# EAGLE design csa_copro_addon-v1.0b (EAGLE 4.15)
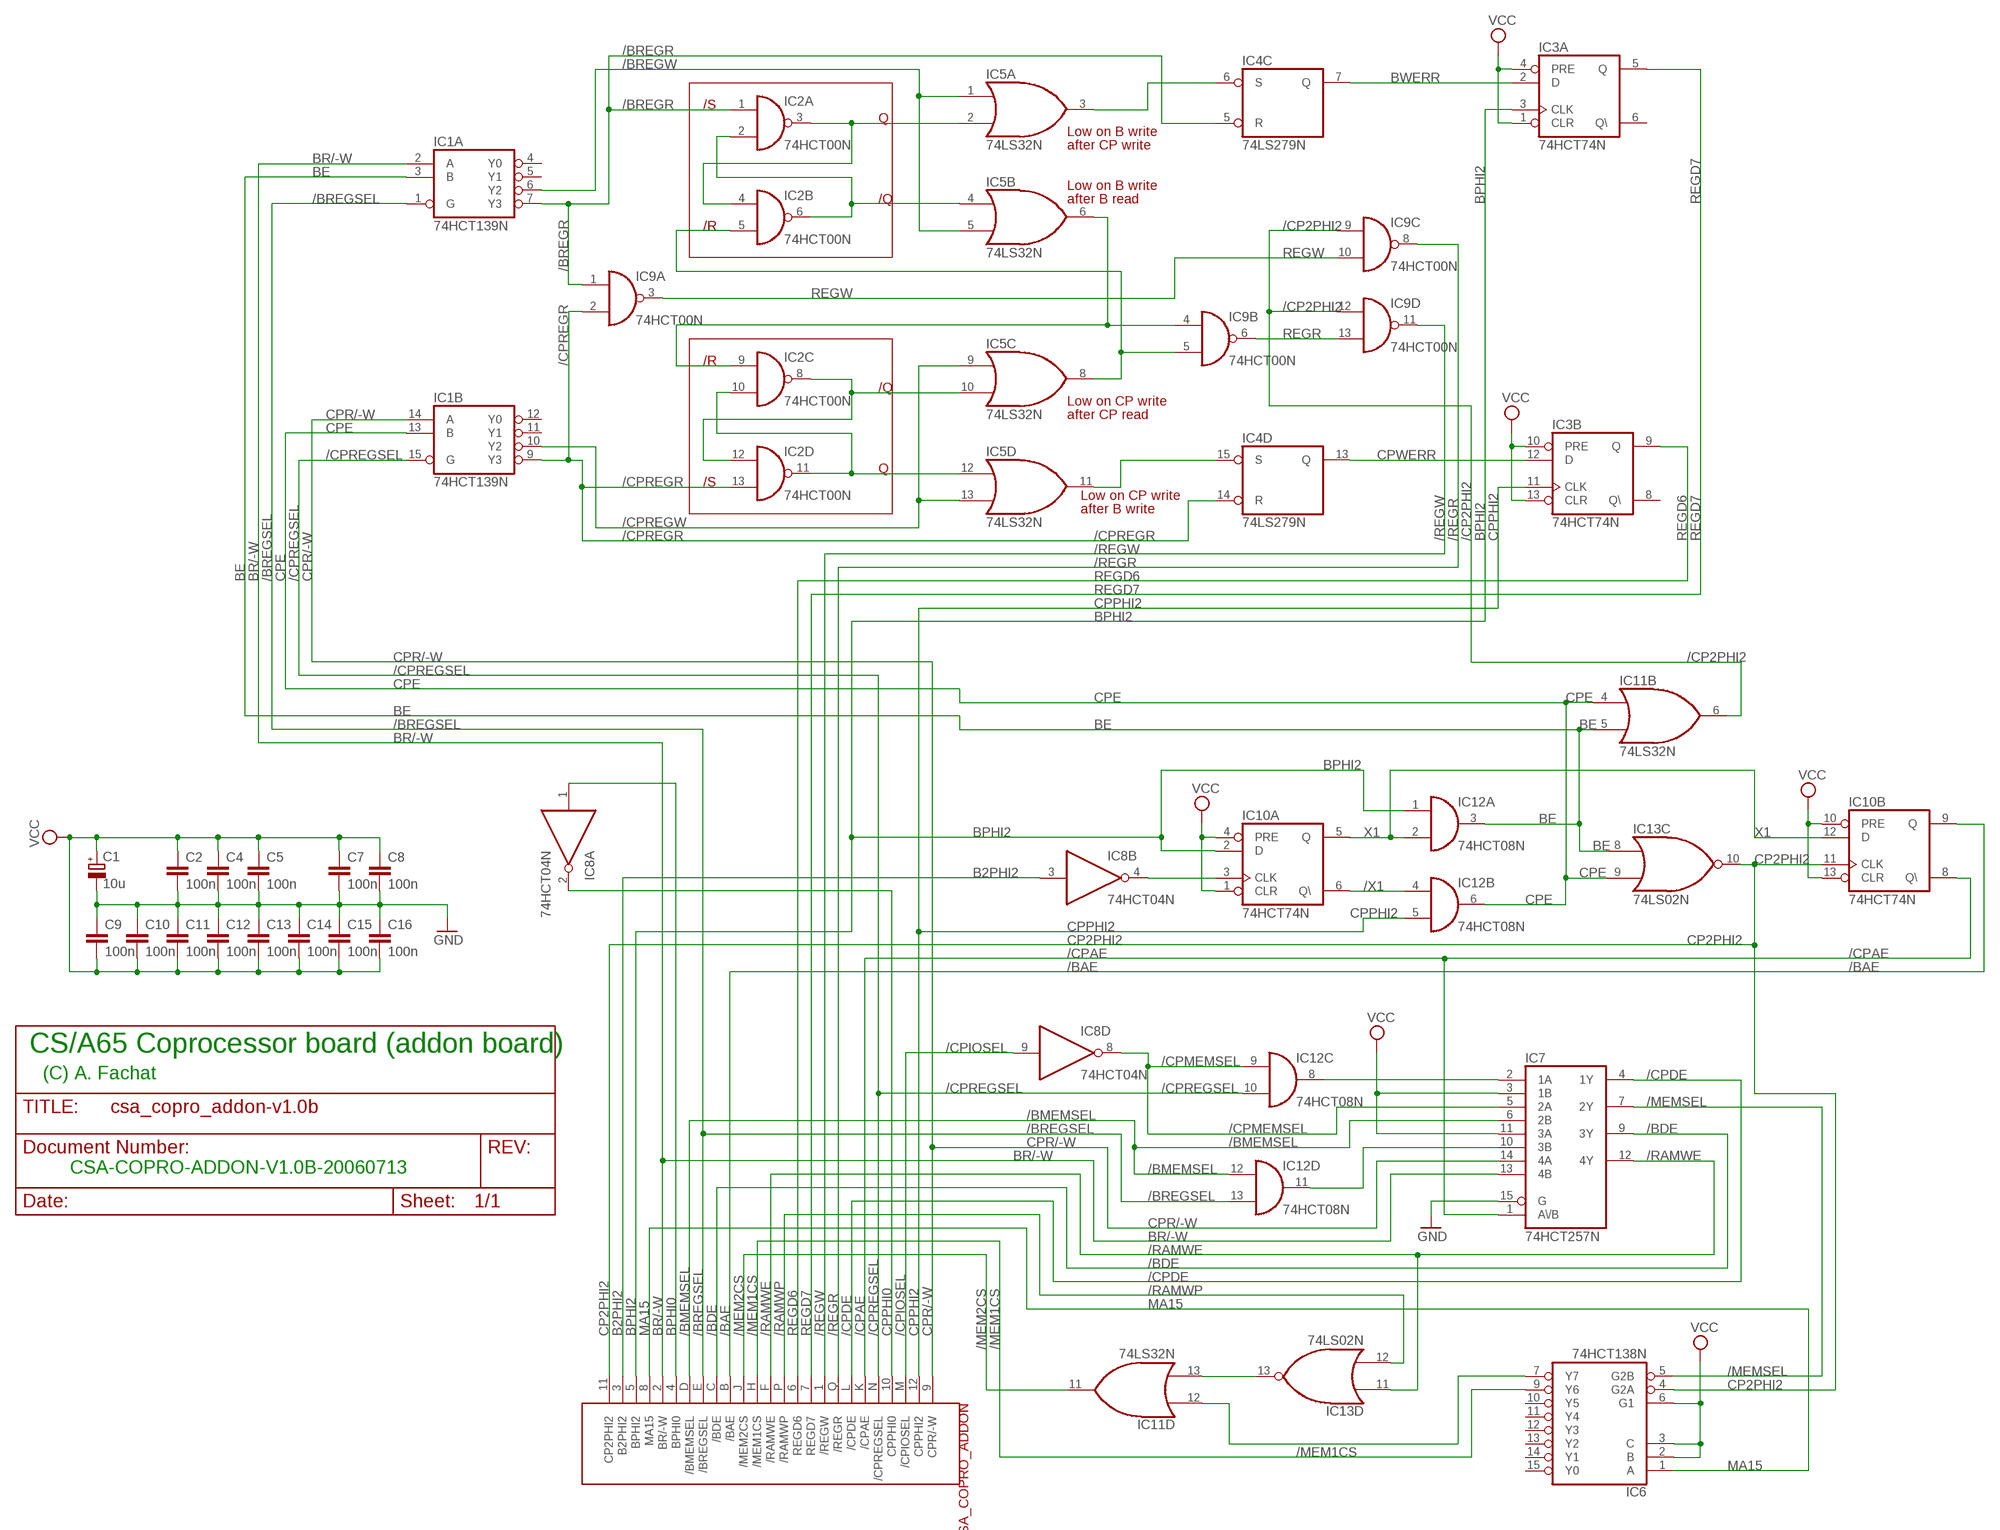
[diagram p0: schematic, sheet 1]

## Parts
C1  10u  CPOL-EUE2.5-5  [E2,5-5]
C2  100n  C-EU025-025X050  [C025-025X050]
C4  100n  C-EU025-025X050  [C025-025X050]
C5  100n  C-EU025-025X050  [C025-025X050]
C7  100n  C-EU025-025X050  [C025-025X050]
C8  100n  C-EU025-025X050  [C025-025X050]
C9  100n  C-EU025-025X050  [C025-025X050]
C10  100n  C-EU025-025X050  [C025-025X050]
C11  100n  C-EU025-025X050  [C025-025X050]
C12  100n  C-EU025-025X050  [C025-025X050]
C13  100n  C-EU025-025X050  [C025-025X050]
C14  100n  C-EU025-025X050  [C025-025X050]
C15  100n  C-EU025-025X050  [C025-025X050]
C16  100n  C-EU025-025X050  [C025-025X050]
IC1  74HCT139N  [DIL16]
IC2  74HCT00N  [DIL14]
IC3  74HCT74N  [DIL14]
IC4  74LS279N  [DIL16]
IC5  74LS32N  [DIL14]
IC6  74HCT138N  [DIL16]
IC7  74HCT257N  [DIL16]
IC8  74HCT04N  [DIL14]
IC9  74HCT00N  [DIL14]
IC10  74HCT74N  [DIL14]
IC11  74LS32N  [DIL14]
IC12  74HCT08N  [DIL14]
IC13  74LS02N  [DIL14]
P3  CSA_COPRO_ADDON  [FLAT28]

## Nets
/BAE: IC10.9(B:Q) P3.B(/BAE)
/BDE: IC7.9(3Y) P3.C(/BDE)
/BMEMSEL: IC7.6(2B) IC12.12(D:I0) P3.D(/BMEMSEL)
/BREGR: IC1.7(A:Y3) IC2.1(A:I0) IC4.5(C:R) IC9.1(A:I0)
/BREGSEL: IC1.1(A:G) IC12.13(D:I1) P3.E(/BREGSEL)
/BREGW: IC1.6(A:Y2) IC5.1(A:I0) IC5.5(B:I1)
/CP2PHI2: IC9.9(C:I0) IC9.12(D:I0) IC11.6(B:O)
/CPAE: IC7.1(A\/B) IC10.8(B:Q\) P3.K(/CPAE)
/CPDE: IC7.4(1Y) P3.L(/CPDE)
/CPIOSEL: IC8.9(D:I) P3.M(/CPIOSEL)
/CPMEMSEL: IC7.5(2A) IC8.8(D:O) IC12.9(C:I0)
/CPREGR: IC1.9(B:Y3) IC2.13(D:I1) IC4.14(D:R) IC9.2(A:I1)
/CPREGSEL: IC1.15(B:G) IC12.10(C:I1) P3.N(/CPREGSEL)
/CPREGW: IC1.10(B:Y2) IC5.9(C:I0) IC5.13(D:I1)
/MEM1CS: IC6.9(Y6) P3.H(/MEM1CS)
/MEM2CS: IC11.11(D:O) P3.J(/MEM2CS)
/MEMSEL: IC6.5(G2B) IC7.7(2Y)
/RAMWE: IC7.12(4Y) IC13.11(D:I0) P3.F(/RAMWE)
/RAMWP: IC13.12(D:I1) P3.P(/RAMWP)
/REGR: IC9.8(C:O) P3.Q(/REGR)
/REGW: IC9.11(D:O) P3.1(/REGW)
/X1: IC10.6(A:Q\) IC12.4(B:I0)
B2PHI2: IC8.3(B:I) P3.3(B2PHI2)
BE: IC1.3(A:B) IC11.5(B:I1) IC12.3(A:O) IC13.8(C:I0)
BPHI0: IC8.1(A:I) P3.4(BPHI0)
BPHI2: IC3.3(A:CLK) IC10.2(A:D) IC12.1(A:I0) P3.5(BPHI2)
BR/-W: IC1.2(A:A) IC7.13(4B) P3.2(BR/-W)
BWERR: IC3.2(A:D) IC4.7(C:Q)
CP2PHI2: IC6.4(G2A) IC10.11(B:CLK) IC13.10(C:O) P3.11(CP2PHI2)
CPE: IC1.13(B:B) IC11.4(B:I0) IC12.6(B:O) IC13.9(C:I1)
CPPHI0: IC8.2(A:O) P3.10(CPPHI0)
CPPHI2: IC3.11(B:CLK) IC12.5(B:I1) P3.12(CPPHI2)
CPR/-W: IC1.14(B:A) IC7.14(4A) P3.9(CPR/-W)
CPWERR: IC3.12(B:D) IC4.13(D:Q)
GND: C1.- C2.2 C4.2 C5.2 C7.2 C8.2 C9.1 C10.1 C11.1 C12.1 C13.1 C14.1 C15.1 C16.1 IC7.15(G)
MA15: IC6.1(A) P3.8(MA15)
N$9: IC2.3(A:O) IC2.4(B:I0) IC5.2(A:I1)
N$10: IC2.2(A:I1) IC2.6(B:O) IC5.4(B:I0)
N$11: IC2.8(C:O) IC2.12(D:I0) IC5.10(C:I1)
N$12: IC2.10(C:I1) IC2.11(D:O) IC5.12(D:I0)
N$14: IC4.15(D:S) IC5.11(D:O)
N$16: IC6.7(Y7) IC11.12(D:I0)
N$17: IC2.5(B:I1) IC5.8(C:O) IC9.5(B:I1)
N$18: IC2.9(C:I0) IC5.6(B:O) IC9.4(B:I0)
N$19: IC11.13(D:I1) IC13.13(D:O)
N$20: IC4.6(C:S) IC5.3(A:O)
N$32: IC8.4(B:O) IC10.3(A:CLK)
N$41: IC7.2(1A) IC12.8(C:O)
N$43: IC7.10(3B) IC12.11(D:O)
REGD6: IC3.9(B:Q) P3.6(REGD6)
REGD7: IC3.5(A:Q) P3.7(REGD7)
REGR: IC9.6(B:O) IC9.13(D:I1)
REGW: IC9.3(A:O) IC9.10(C:I1)
VCC: C1.+ C2.1 C4.1 C5.1 C7.1 C8.1 C9.2 C10.2 C11.2 C12.2 C13.2 C14.2 C15.2 C16.2 IC3.1(A:CLR) IC3.4(A:PRE) IC3.10(B:PRE) IC3.13(B:CLR) IC6.2(B) IC6.3(C) IC6.6(G1) IC7.3(1B) IC7.11(3A) IC10.1(A:CLR) IC10.4(A:PRE) IC10.10(B:PRE) IC10.13(B:CLR)
X1: IC10.5(A:Q) IC10.12(B:D) IC12.2(A:I1)
Unconnected: IC1.4(A:Y0) IC1.5(A:Y1) IC1.11(B:Y1) IC1.12(B:Y0) IC3.6(A:Q\) IC3.8(B:Q\) IC4.1(A:R) IC4.2(A:S1) IC4.3(A:S2) IC4.4(A:Q) IC4.9(B:Q) IC4.10(B:R) IC4.11(B:S1) IC4.12(B:S2) IC6.10(Y5) IC6.11(Y4) IC6.12(Y3) IC6.13(Y2) IC6.14(Y1) IC6.15(Y0) IC8.5(C:I) IC8.6(C:O) IC8.10(E:O) IC8.11(E:I) IC8.12(F:O) IC8.13(F:I) IC11.1(A:I0) IC11.2(A:I1) IC11.3(A:O) IC11.8(C:O) IC11.9(C:I0) IC11.10(C:I1) IC13.1(A:O) IC13.2(A:I0) IC13.3(A:I1) IC13.4(B:O) IC13.5(B:I0) IC13.6(B:I1)

## Notes on the sheet
- /S
- Q
- Low on B write
- after CP write
- Low on B write
- /Q | after B read
- /R
- /R
- /Q
- Low on CP write
- after CP read
- Q
- /S
- Low on CP write
- after B write
- CS/A65 Coprocessor board (addon board)
- (C) A. Fachat
- CSA-COPRO-ADDON-V1.0B-20060713

## Power pins joined to a net without a drawn wire
GND: IC1.8(P:GND) IC2.7(P:GND) IC3.7(P:GND) IC4.8(P:GND) IC5.7(P:GND) IC6.8(GND) IC7.8(GND) IC8.7(P:GND) IC9.7(P:GND) IC10.7(P:GND) IC11.7(P:GND) IC12.7(P:GND) IC13.7(P:GND) P3.14(GND)
VCC: IC1.16(P:VCC) IC2.14(P:VCC) IC3.14(P:VCC) IC4.16(P:VCC) IC5.14(P:VCC) IC6.16(VCC) IC7.16(VCC) IC8.14(P:VCC) IC9.14(P:VCC) IC10.14(P:VCC) IC11.14(P:VCC) IC12.14(P:VCC) IC13.14(P:VCC) P3.A(VCC)

## Library data of the parts
C1 = rcl:CPOL-EU: POLARIZED CAPACITOR, European symbol
C2 C4 C5 C7-C16 = rcl:C-EU: CAPACITOR, European symbol
IC1 = 74xx-eu:74*139: Dual 2-line to 4-line DECODER/DEMULTIPLEXER
IC2 IC9 = 74xx-eu:74*00: Quad 2-input NAND gate
IC3 IC10 = 74xx-eu:74*74: Dual D type positive edge triggered FLIP FLOP, preset and clear
IC4 = 74xx-eu:74*279: Quadruple S-R LATCH
IC5 IC11 = 74xx-us:74*32: Quad 2-input OR gate
IC6 = 74xx-eu:74*138: 3-line to 8-line DECODER/DEMULTIPLEXER
IC7 = 74xx-eu:74*257: Quadruple 2-to 1 line data SELECTOR/MULTIPLEXER
IC8 = 74xx-eu:74*04: Hex INVERTER
IC12 = 74xx-eu:74*08: Quad 2-input AND gate
IC13 = 74xx-us:74*02: Quad 2-input NOR gate
P3 = csa:CSA_COPRO_ADDON

## Board
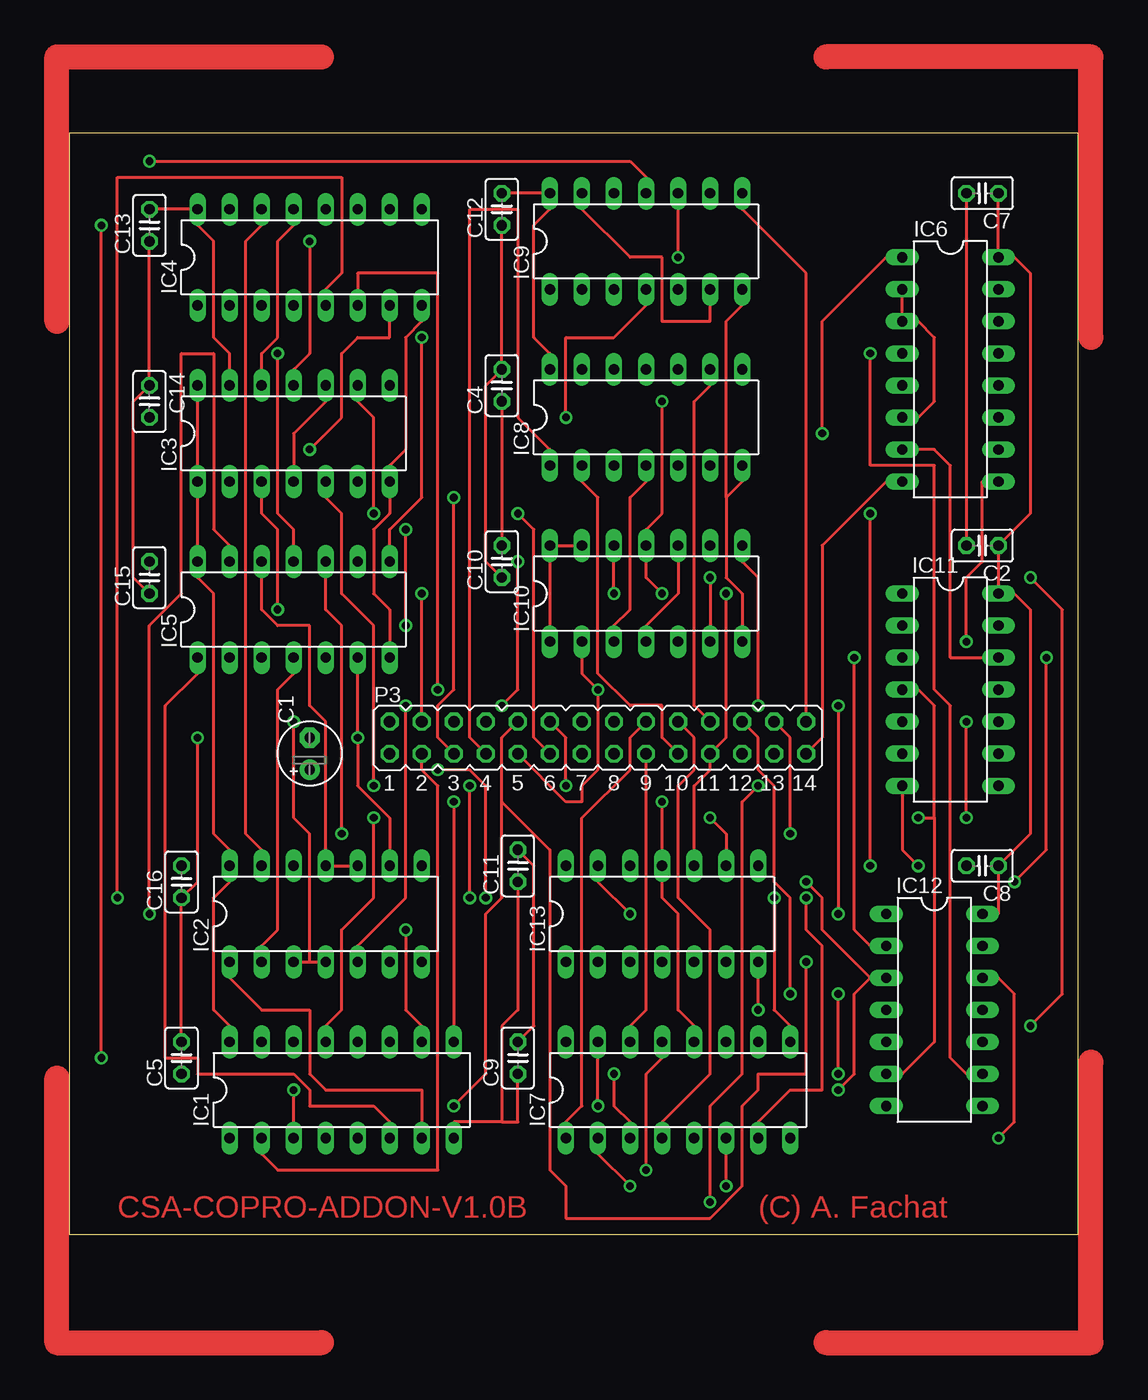
[diagram p1: board, top side]
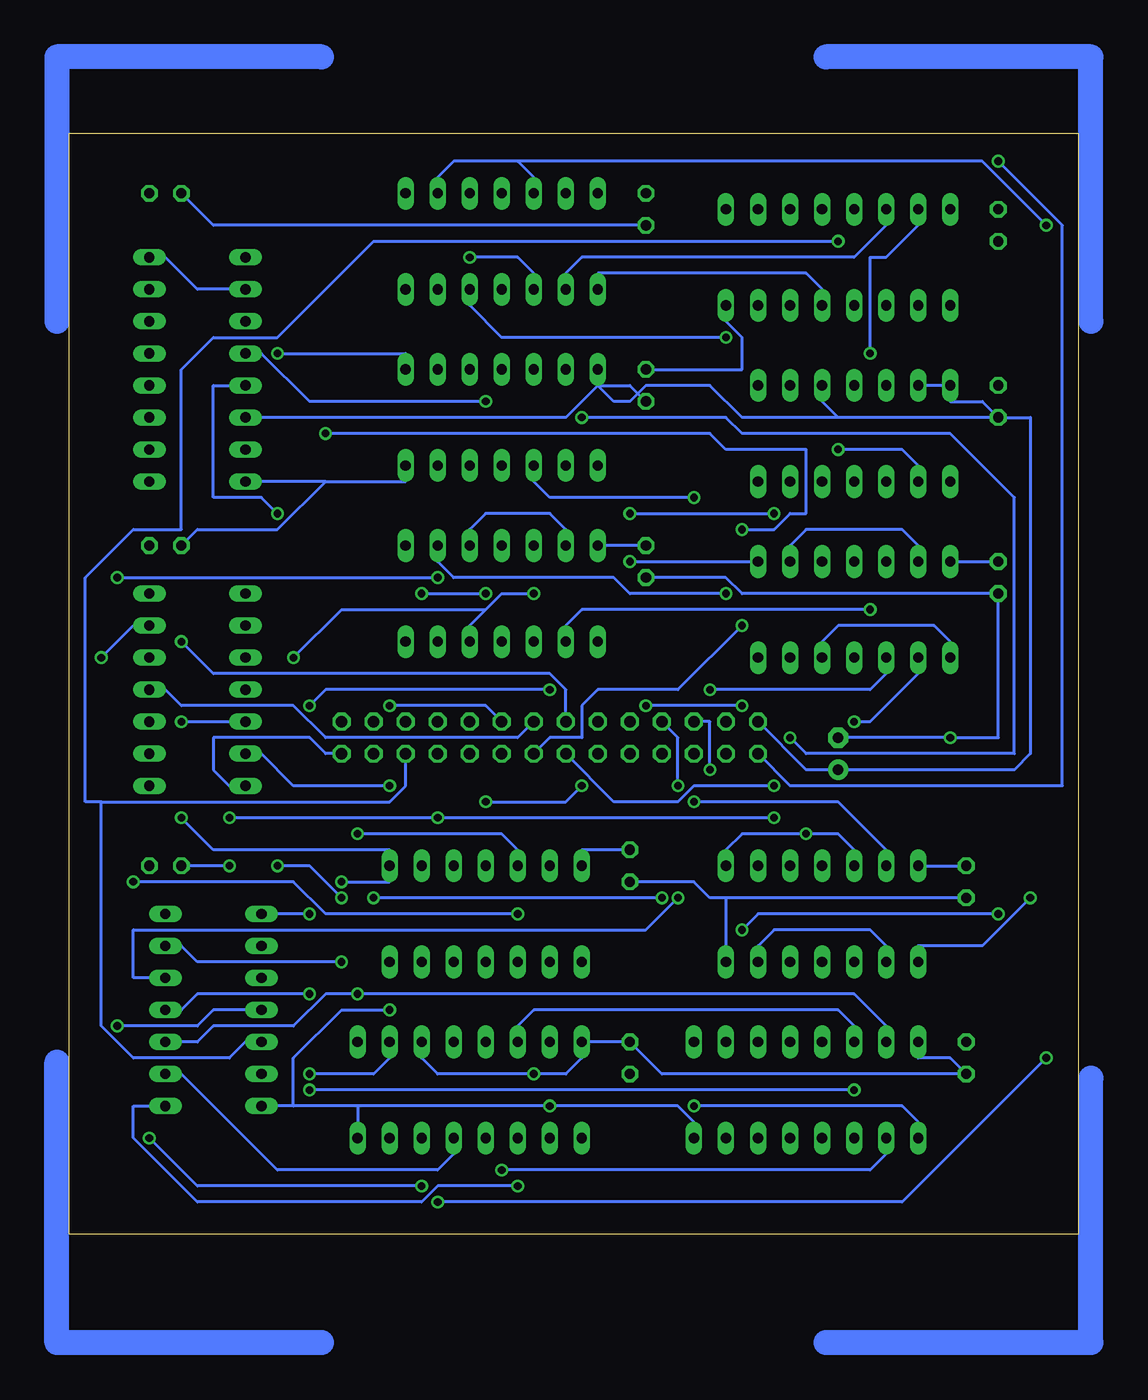
[diagram p2: board, bottom side, seen from below]

Size 80 x 87.3 mm. Coordinates in mm from the lower left corner, seen from the top.
Outline: 0,0 80,0 80,87.3 0,87.3 0,0
Copper layers (1*16): Top 0.035mm / dielectric 1.5mm / Bottom 0.035mm
Design rules "default": minimum track width 10mil, minimum drill 24mil, track to track 8mil, track to pad 8mil, pad to pad 8mil, via to via 8mil, smd to smd 8mil, copper to edge 40mil, drill to drill 8mil, minimum pad ring 10mil, minimum via ring 8mil, stop-mask expansion 4mil, vias tented up to drill 0mil, thermal gap 10mil

### Footprints (pad centres in the part's own frame; a part is rotated, then mirrored left to right if it is on the bottom)
E2,5-5 = drill 0.813 pad 1.6 round: + -1.27,0 | drill 0.813 pad 1.6 octagon: - 1.27,0
C025-025X050 = drill 0.813 octagon: 1 -1.27,0; 2 1.27,0
DIL16 = drill 0.813 long: 1 -8.89,-3.81; 2 -6.35,-3.81; 3 -3.81,-3.81; 4 -1.27,-3.81; 5 1.27,-3.81; 6 3.81,-3.81; 7 6.35,-3.81; 8 8.89,-3.81; 9 8.89,3.81; 10 6.35,3.81; 11 3.81,3.81; 12 1.27,3.81; 13 -1.27,3.81; 14 -3.81,3.81; 15 -6.35,3.81; 16 -8.89,3.81
DIL14 = drill 0.813 long: 1 -7.62,-3.81; 2 -5.08,-3.81; 3 -2.54,-3.81; 4 0,-3.81; 5 2.54,-3.81; 6 5.08,-3.81; 7 7.62,-3.81; 8 7.62,3.81; 9 5.08,3.81; 10 2.54,3.81; 11 0,3.81; 12 -2.54,3.81; 13 -5.08,3.81; 14 -7.62,3.81
FLAT28 = drill 0.914 octagon: 1 -15.24,-1.27; 2 -12.7,-1.27; 3 -10.16,-1.27; 4 -7.62,-1.27; 5 -5.08,-1.27; 6 -2.54,-1.27; 7 0,-1.27; 8 2.54,-1.27; 9 5.08,-1.27; 10 7.62,-1.27; 11 10.16,-1.27; 12 12.7,-1.27; 13 15.24,-1.27; 14 17.78,-1.27; A -15.24,1.27; B -12.7,1.27; C -10.16,1.27; D -7.62,1.27; E -5.08,1.27; F -2.54,1.27; H 0,1.27; J 2.54,1.27; K 5.08,1.27; L 7.62,1.27; M 10.16,1.27; N 12.7,1.27; P 15.24,1.27; Q 17.78,1.27

### Placement (x,y rotation side)
C1  19.05,38.1 90 top
C2  72.39,54.61 180 top
C4  34.29,67.31 90 top
C5  8.89,13.97 90 top
C7  72.39,82.55 180 top
C8  72.39,29.21 180 top
C9  35.56,13.97 90 top
C10  34.29,53.34 90 top
C11  35.56,29.21 90 top
C12  34.29,81.28 90 top
C13  6.35,80.01 90 top
C14  6.35,66.04 270 top
C15  6.35,52.07 90 top
C16  8.89,27.94 90 top
IC1  21.59,11.43 0 top
IC2  20.32,25.4 0 top
IC3  17.78,63.5 0 top
IC4  19.05,77.47 0 top
IC5  17.78,49.53 0 top
IC6  69.85,68.58 270 top
IC7  48.26,11.43 0 top
IC8  45.72,64.77 0 top
IC9  45.72,78.74 0 top
IC10  45.72,50.8 0 top
IC11  69.85,43.18 270 top
IC12  68.58,17.78 270 top
IC13  46.99,25.4 0 top
P3  40.64,39.37 0 top

### Tracks (layer width: path | path; a pad name or v marks a point on that pad's centre or on a via)
/BAE  (via drill 0.61)
  Top 0.254: P3.B v27.94,50.8
  Bottom 0.254: v27.94,50.8 35.56,50.8 36.83,52.07 49.53,52.07 50.8,53.34 IC10.9
/BDE  (via drill 0.61)
  Top 0.254: v55.88,26.67 55.88,17.78 57.15,16.51 IC7.9 | v33.02,26.67 33.02,35.56 31.75,36.83 v29.21,36.83
  Bottom 0.254: v33.02,26.67 v55.88,26.67 | v29.21,36.83 29.21,40.64 P3.C
/BMEMSEL  (via drill 0.61)
  Top 0.254: v73.66,7.62 74.93,8.89 74.93,19.05 73.66,20.32 IC12.12 | v52.07,3.81 IC7.6 | v31.75,26.67 v31.75,35.56
  Bottom 0.254: v52.07,3.81 69.85,3.81 v73.66,7.62 | P3.D 31.75,39.37 v31.75,35.56 | v31.75,26.67 34.29,24.13 74.93,24.13 74.93,20.32 IC12.12
/BREGR  (via drill 0.61)
  Top 0.254: IC2.1 12.7,20.32 15.24,17.78 19.05,17.78 19.05,12.7 20.32,11.43 27.94,11.43 IC1.7 | v3.81,26.67 3.81,83.82 21.59,83.82 21.59,76.2 20.32,74.93 IC4.5
  Bottom 0.254: IC4.5 20.32,74.93 21.59,76.2 38.1,76.2 IC9.1 | v3.81,26.67 7.62,22.86 12.7,22.86 IC2.1
/BREGSEL  (via drill 0.61)
  Top 0.254: v30.48,10.16 33.02,12.7 33.02,25.4 34.29,26.67 34.29,34.29 | 34.29,34.29 34.29,39.37 P3.E | v58.42,21.59 58.42,12.7 54.61,12.7 54.61,11.43 53.34,10.16 53.34,3.81 50.8,1.27 39.37,1.27 39.37,3.81 38.1,5.08 38.1,30.48 34.29,34.29
  Bottom 0.254: v30.48,10.16 13.97,10.16 12.7,8.89 IC1.1 | v58.42,21.59 69.85,21.59 71.12,22.86 IC12.13
/BREGW
  Top 0.254: IC1.6 25.4,8.89 24.13,10.16 19.05,10.16 19.05,11.43 17.78,12.7 10.16,12.7 10.16,13.97 7.62,13.97 7.62,41.91 10.16,44.45 IC5.1
  Bottom 0.254: IC5.1 10.16,46.99 11.43,48.26 19.05,48.26 20.32,46.99 IC5.5
/CP2PHI2  (via drill 0.61)
  Top 0.254: v54.61,35.56 53.34,34.29 53.34,12.7 50.8,10.16 v50.8,2.54 | v2.54,13.97 v2.54,80.01
  Bottom 0.254: 44.45,85.09 43.18,83.82 IC9.12 | 44.45,85.09 49.53,85.09 50.8,83.82 IC9.9 | v54.61,35.56 62.23,35.56 64.77,38.1 IC11.6 | v50.8,2.54 13.97,2.54 v2.54,13.97 | v2.54,80.01 7.62,85.09 44.45,85.09
/CPAE  (via drill 0.61)
  Top 0.254: P3.K 44.45,39.37 44.45,36.83 40.64,33.02 40.64,10.16 39.37,8.89 IC7.1 | v54.61,41.91 54.61,52.07 53.34,53.34 IC10.8
  Bottom 0.254: v54.61,41.91 46.99,41.91 P3.K
/CPDE
  Top 0.254: P3.L 49.53,39.37 49.53,36.83 48.26,35.56 48.26,26.67 50.8,24.13 50.8,12.7 46.99,8.89 IC7.4
/CPIOSEL
  Top 0.254: P3.M 49.53,41.91 49.53,66.04 50.8,67.31 IC8.9
/CPMEMSEL  (via drill 0.61)
  Top 0.254: v63.5,69.85 63.5,60.96 68.58,60.96 68.58,43.18 69.85,41.91 69.85,13.97 71.12,12.7 IC12.9
  Bottom 0.254: IC7.5 49.53,6.35 50.8,5.08 63.5,5.08 71.12,12.7 IC12.9 | v63.5,69.85 53.34,69.85 IC8.8
/CPREGR  (via drill 0.61)
  Top 0.254: IC2.13 15.24,30.48 13.97,31.75 13.97,78.74 15.24,80.01 IC4.14 | v30.48,34.29 IC1.9
  Bottom 0.254: v30.48,34.29 19.05,34.29 15.24,30.48 IC2.13 | IC9.2 40.64,76.2 39.37,77.47 17.78,77.47 15.24,80.01 IC4.14
/CPREGSEL  (via drill 0.61)
  Top 0.254: P3.N 54.61,39.37 54.61,36.83 55.88,35.56 55.88,27.94 57.15,26.67 v57.15,19.05
  Bottom 0.254: IC1.15 15.24,16.51 17.78,19.05 v57.15,19.05 59.69,19.05 62.23,16.51 68.58,16.51 69.85,15.24 IC12.10
/CPREGW  (via drill 0.61)
  Top 0.254: v26.67,24.13 26.67,17.78 27.94,16.51 IC1.10 | v6.35,25.4 6.35,48.26 8.89,50.8 8.89,69.85 11.43,69.85 11.43,55.88 12.7,54.61 IC5.13
  Bottom 0.254: IC5.13 12.7,54.61 13.97,55.88 21.59,55.88 22.86,54.61 IC5.9 | v26.67,24.13 25.4,25.4 v6.35,25.4
/MEM1CS  (via drill 0.61)
  Top 0.254: v71.12,46.99 71.12,52.07 72.39,53.34 72.39,59.69 IC6.9
  Bottom 0.254: v71.12,46.99 68.58,44.45 41.91,44.45 40.64,43.18 P3.H
/MEM2CS
  Bottom 0.254: P3.J 44.45,39.37 59.69,39.37 62.23,41.91 71.12,41.91 72.39,43.18 IC11.11
/MEMSEL  (via drill 0.61)
  Top 0.254: v58.42,26.67 58.42,24.13 59.69,22.86 59.69,11.43 57.15,11.43 54.61,8.89 IC7.7 | v63.5,29.21 v63.5,57.15
  Bottom 0.254: v58.42,26.67 60.96,29.21 v63.5,29.21 | v63.5,57.15 64.77,58.42 68.58,58.42 68.58,67.31 IC6.5
/RAMWE  (via drill 0.61)
  Top 0.254: IC7.12 49.53,16.51 48.26,17.78 48.26,25.4 46.99,26.67 IC13.11 v46.99,34.29 | P3.F 39.37,39.37 v39.37,35.56
  Bottom 0.254: v39.37,35.56 40.64,34.29 v46.99,34.29
/RAMWP  (via drill 0.61)
  Top 0.254: v57.15,31.75 57.15,39.37 P3.P
  Bottom 0.254: v57.15,31.75 45.72,31.75 44.45,30.48 IC13.12
/REGR
  Top 0.254: P3.Q 58.42,76.2 53.34,81.28 IC9.8
/REGW  (via drill 0.61)
  Top 0.254: v6.35,85.09 44.45,85.09 45.72,83.82 IC9.11
  Bottom 0.254: v6.35,85.09 1.27,80.01 1.27,35.56 22.86,35.56 P3.1
/X1  (via drill 0.61)
  Top 0.254: v76.2,16.51 78.74,19.05 78.74,49.53 v76.2,52.07 | v50.8,52.07 IC10.6
  Bottom 0.254: v76.2,16.51 69.85,16.51 68.58,17.78 IC12.4 | v76.2,52.07 v50.8,52.07
B2PHI2  (via drill 0.61)
  Top 0.254: v30.48,58.42 30.48,43.18 29.21,41.91 29.21,39.37 P3.3
  Bottom 0.254: v30.48,58.42 41.91,58.42 43.18,59.69 IC8.3
BE  (via drill 0.61)
  Top 0.254: v60.96,11.43 62.23,12.7 62.23,19.05 63.5,20.32 | IC1.3 v17.78,11.43 | v58.42,27.94 59.69,26.67 59.69,24.13 63.5,20.32 | 63.5,20.32 IC12.3 | v71.12,33.02 v71.12,40.64
  Bottom 0.254: v17.78,11.43 v60.96,11.43 | v58.42,27.94 54.61,27.94 IC13.8 54.61,30.48 68.58,30.48 v71.12,33.02 | v71.12,40.64 IC11.5
BPHI0
  Top 0.254: P3.4 31.75,39.37 31.75,81.28 35.56,81.28 35.56,64.77 38.1,62.23 IC8.1
BPHI2  (via drill 0.61)
  Top 0.254: v16.51,49.53 16.51,55.88 15.24,57.15 IC3.3 | v60.96,41.91 v60.96,25.4 | IC10.2 40.64,44.45 v41.91,43.18 41.91,36.83 40.64,35.56 40.64,34.29 39.37,34.29 P3.5
  Bottom 0.254: v16.51,49.53 39.37,49.53 40.64,48.26 IC10.2 | v60.96,41.91 59.69,43.18 v41.91,43.18 | v60.96,25.4 IC12.1
BR/-W  (via drill 0.61)
  Top 0.254: P3.2 27.94,36.83 29.21,35.56 29.21,5.08 16.51,5.08 15.24,6.35 IC1.2 | v45.72,5.08 45.72,12.7 46.99,13.97 IC7.13
  Bottom 0.254: v45.72,5.08 16.51,5.08 15.24,6.35 IC1.2
BWERR  (via drill 0.61)
  Top 0.254: v19.05,62.23 21.59,64.77 21.59,69.85 22.86,71.12 25.4,71.12 IC4.7
  Bottom 0.254: v19.05,62.23 13.97,62.23 12.7,60.96 IC3.2
CP2PHI2  (via drill 0.61)
  Top 0.254: IC13.10 49.53,35.56 50.8,36.83 P3.11 52.07,39.37 v52.07,50.8 | v46.99,66.04 46.99,57.15 45.72,55.88 IC10.11 45.72,52.07 v46.99,50.8
  Bottom 0.254: v46.99,66.04 60.96,66.04 64.77,69.85 IC6.4 | v52.07,50.8 v46.99,50.8
CPE  (via drill 0.61)
  Top 0.254: 68.58,33.02 68.58,41.91 67.31,43.18 IC11.4 | 68.58,33.02 68.58,15.24 66.04,12.7 IC12.6 | v24.13,33.02 24.13,26.67 21.59,24.13 21.59,17.78 20.32,16.51 IC1.13 | v50.8,33.02 52.07,31.75 IC13.9 | v67.31,33.02 68.58,33.02
  Bottom 0.254: v24.13,33.02 v50.8,33.02 v67.31,33.02
CPPHI0
  Top 0.254: P3.10 46.99,39.37 46.99,41.91 44.45,41.91 41.91,44.45 41.91,58.42 40.64,59.69 IC8.2
CPPHI2  (via drill 0.61)
  Top 0.254: v19.05,78.74 19.05,69.85 17.78,68.58 IC3.11
  Bottom 0.254: 77.47,34.29 77.47,16.51 74.93,13.97 67.31,13.97 66.04,15.24 IC12.5 | 77.47,34.29 54.61,34.29 53.34,35.56 P3.12 | v19.05,78.74 55.88,78.74 63.5,71.12 68.58,71.12 71.12,68.58 71.12,55.88 74.93,55.88 78.74,52.07 78.74,34.29 77.47,34.29
CPR/-W
  Top 0.254: P3.9 45.72,17.78 44.45,16.51 IC7.14
  Bottom 0.254: IC1.14 17.78,16.51 19.05,17.78 43.18,17.78 44.45,16.51 IC7.14
CPWERR
  Top 0.254: IC3.12 15.24,69.85 16.51,71.12 16.51,78.74 17.78,80.01 IC4.13
GND  (via drill 0.61)
  Top 0.254: C5.2 C16.1 10.16,27.94 v10.16,39.37 | 34.29,8.89 35.56,8.89 C9.1 | 34.29,8.89 30.48,8.89 IC1.8 | v41.91,10.16 IC7.15 | v54.61,17.78 IC13.7 | C11.1 35.56,17.78 34.29,16.51 34.29,8.89 | IC5.7 25.4,49.53 24.13,50.8 24.13,55.88 25.4,57.15 IC3.7 25.4,60.96 26.67,62.23 26.67,71.12 27.94,72.39 IC4.8 | C10.1 33.02,53.34 33.02,67.31 C4.2 C12.1 | C13.1 C14.1 5.08,66.04 5.08,52.07 C15.1 | C7.2 C2.2 | v67.31,29.21 66.04,30.48 IC11.7 | 52.07,58.42 52.07,52.07 53.34,50.8 IC10.7 | 52.07,58.42 53.34,59.69 IC8.7 | 52.07,58.42 52.07,72.39 53.34,73.66 IC9.7 | P3.14 59.69,39.37 59.69,54.61 64.77,59.69 IC6.8
  Bottom 0.254: C16.1 27.94,26.67 | 27.94,26.67 IC2.7 | C11.1 30.48,27.94 29.21,26.67 27.94,26.67 | 57.15,10.16 62.23,10.16 | 57.15,10.16 v41.91,10.16 31.75,10.16 30.48,8.89 IC1.8 | 62.23,10.16 IC12.7 | 57.15,10.16 IC7.8 | v54.61,17.78 58.42,17.78 62.23,13.97 62.23,10.16 | C4.2 26.67,68.58 26.67,71.12 27.94,72.39 IC4.8 | C1.- v10.16,39.37 6.35,39.37 C15.1 26.67,50.8 27.94,52.07 C10.1 | P3.14 59.69,38.1 60.96,39.37 68.58,39.37 68.58,36.83 67.31,35.56 IC11.7 | v67.31,29.21 C8.2 | 59.69,59.69 53.34,59.69 IC8.7 | 59.69,59.69 IC6.8 | C2.2 69.85,55.88 63.5,55.88 59.69,59.69 | C12.1 68.58,80.01 C7.2
MA15  (via drill 0.61)
  Top 0.254: v59.69,63.5 59.69,72.39 64.77,77.47 IC6.1 | v26.67,48.26 v26.67,55.88
  Bottom 0.254: v59.69,63.5 29.21,63.5 27.94,62.23 21.59,62.23 21.59,57.15 22.86,57.15 24.13,55.88 v26.67,55.88 | v26.67,48.26 31.75,43.18 38.1,43.18 39.37,41.91 39.37,39.37 41.91,39.37 P3.8
N$1
  Top 2: 20,-8.62 -1,-8.62 -1,12.38
N$2
  Top 2: 60,-8.62 81,-8.62 81,13.65
N$3
  Top 2: 20,93.38 -1,93.38 -1,72.38
N$4
  Top 2: 81,71.11 81,93.38 60,93.38
N$5
  Bottom 2: 20,-8.62 -1,-8.62 -1,12.38
N$6
  Bottom 2: 60,-8.62 81,-8.62 81,13.65
N$7
  Bottom 2: 20,93.38 -1,93.38 -1,72.38
N$8
  Bottom 2: 81,72.38 81,93.38 60,93.38
N$9  (via drill 0.61)
  Top 0.254: 19.05,21.59 IC2.4 | IC2.3 19.05,21.59 | v17.78,40.64 17.78,33.02 19.05,31.75 19.05,21.59
  Bottom 0.254: v17.78,40.64 16.51,40.64 12.7,44.45 IC5.2
N$10
  Top 0.254: IC5.4 17.78,44.45 16.51,43.18 16.51,24.13 15.24,22.86 IC2.2
  Bottom 0.254: IC2.2 15.24,22.86 16.51,24.13 24.13,24.13 25.4,22.86 IC2.6
N$11  (via drill 0.61)
  Top 0.254: v21.59,31.75 21.59,48.26 20.32,49.53 IC5.10
  Bottom 0.254: IC2.12 17.78,30.48 19.05,31.75 v21.59,31.75 26.67,31.75 27.94,30.48 IC2.8
N$12
  Top 0.254: IC2.10 IC2.11 20.32,40.64 19.05,41.91 19.05,48.26 16.51,48.26 15.24,49.53 IC5.12
N$14  (via drill 0.61)
  Top 0.254: v16.51,69.85 16.51,57.15 17.78,55.88 IC5.11
  Bottom 0.254: v16.51,69.85 16.51,77.47 15.24,77.47 12.7,80.01 IC4.15
N$16
  Top 0.254: IC11.12 69.85,45.72 69.85,60.96 68.58,62.23 IC6.7
N$17  (via drill 0.61)
  Top 0.254: v26.67,41.91 26.67,26.67 22.86,22.86 IC2.5 | v34.29,41.91 35.56,43.18 v35.56,53.34 | v27.94,71.12 27.94,58.42 25.4,55.88 IC5.8
  Bottom 0.254: v26.67,41.91 v34.29,41.91 | v35.56,53.34 IC5.8 | v27.94,71.12 45.72,71.12 48.26,73.66 IC9.5
N$18  (via drill 0.61)
  Top 0.254: IC2.9 25.4,33.02 22.86,35.56 v22.86,39.37 IC5.6 | v39.37,64.77 39.37,71.12 43.18,71.12 45.72,73.66 IC9.4
  Bottom 0.254: v39.37,64.77 27.94,64.77 26.67,63.5 10.16,63.5 5.08,58.42 5.08,38.1 21.59,38.1 v22.86,39.37
N$19  (via drill 0.61)
  Top 0.254: v44.45,25.4 41.91,27.94 IC13.13 | v74.93,27.94 77.47,30.48 v77.47,45.72
  Bottom 0.254: v44.45,25.4 59.69,25.4 62.23,27.94 v74.93,27.94 | v77.47,45.72 74.93,48.26 IC11.13
N$20  (via drill 0.61)
  Top 0.254: v29.21,43.18 29.21,76.2 22.86,76.2 IC4.6
  Bottom 0.254: v29.21,43.18 16.51,43.18 15.24,44.45 IC5.3
N$32
  Top 0.254: IC10.3 43.18,48.26 44.45,49.53 44.45,58.42 45.72,59.69 IC8.4
N$41  (via drill 0.61)
  Top 0.254: v44.45,3.81 41.91,6.35 IC7.2
  Bottom 0.254: v44.45,3.81 50.8,3.81 52.07,2.54 69.85,2.54 74.93,7.62 74.93,10.16 IC12.8
N$43  (via drill 0.61)
  Top 0.254: v60.96,12.7 v60.96,19.05
  Bottom 0.254: v60.96,12.7 55.88,12.7 54.61,13.97 IC7.10 | v60.96,19.05 69.85,19.05 71.12,17.78 IC12.11
REGD6  (via drill 0.61)
  Top 0.254: v24.13,57.15 24.13,64.77 22.86,66.04 IC3.9 | v35.56,57.15 36.83,55.88 36.83,39.37 P3.6
  Bottom 0.254: v35.56,57.15 v24.13,57.15
REGD7  (via drill 0.61)
  Top 0.254: v24.13,35.56 24.13,48.26 21.59,50.8 21.59,57.15 20.32,58.42 IC3.5
  Bottom 0.254: v24.13,35.56 30.48,35.56 31.75,34.29 36.83,34.29 P3.7
REGR
  Top 0.254: IC9.13 40.64,81.28 44.45,77.47 46.99,77.47 46.99,72.39 50.8,72.39 IC9.6
REGW  (via drill 0.61)
  Top 0.254: v48.26,77.47 IC9.10
  Bottom 0.254: v48.26,77.47 44.45,77.47 43.18,76.2 IC9.3
VCC  (via drill 0.61)
  Top 0.254: C12.2 IC9.14 38.1,81.28 36.83,80.01 36.83,71.12 38.1,69.85 IC8.14 | IC10.4 45.72,48.26 48.26,50.8 IC10.10 | IC10.1 IC10.14 IC10.13 | C4.1 C10.2 | C7.1 IC6.16 74.93,77.47 76.2,76.2 76.2,57.15 C2.1 IC11.14 74.93,50.8 76.2,49.53 76.2,31.75 C8.1 73.66,25.4 IC12.14 | IC6.6 67.31,64.77 68.58,66.04 68.58,71.12 67.31,72.39 IC6.3 IC6.2 | v43.18,12.7 43.18,10.16 44.45,8.89 IC7.3 | C11.2 36.83,29.21 36.83,16.51 C9.2 | IC1.16 12.7,16.51 11.43,17.78 11.43,26.67 12.7,27.94 IC2.14 12.7,30.48 11.43,31.75 11.43,50.8 10.16,52.07 IC5.14 IC3.1 IC3.14 | IC3.4 17.78,63.5 20.32,66.04 IC3.10 | C13.2 IC4.16 10.16,80.01 11.43,78.74 11.43,71.12 12.7,69.85 IC3.13
  Bottom 0.254: C4.1 35.56,67.31 38.1,67.31 | C10.2 IC10.14 | IC10.10 48.26,55.88 46.99,57.15 41.91,57.15 40.64,55.88 IC10.13 | IC6.16 72.39,77.47 69.85,74.93 IC6.2 | 38.1,67.31 40.64,64.77 IC6.6 | C11.2 39.37,30.48 IC13.14 | IC7.11 52.07,13.97 50.8,12.7 v43.18,12.7 40.64,12.7 39.37,13.97 IC7.16 C9.2 33.02,12.7 C5.1 10.16,13.97 12.7,13.97 IC1.16 | IC2.14 C16.2 | P3.A 21.59,36.83 C1.+ 5.08,36.83 3.81,38.1 3.81,64.77 C14.2 | IC5.14 C15.2 | C14.2 7.62,66.04 10.16,66.04 IC3.14 IC3.13 | 19.05,64.77 20.32,66.04 IC3.10 | C14.2 19.05,64.77 | 38.1,67.31 36.83,66.04 35.56,66.04 34.29,67.31 29.21,67.31 26.67,64.77 19.05,64.77 | 38.1,67.31 IC8.14
X1  (via drill 0.61)
  Top 0.254: v43.18,50.8 IC10.12 | v62.23,45.72 62.23,24.13 63.5,22.86 IC12.2
  Bottom 0.254: 46.99,49.53 45.72,50.8 v43.18,50.8 | 46.99,49.53 48.26,48.26 IC10.5 | v62.23,45.72 58.42,49.53 46.99,49.53

### Text on the board
Top: CSA-COPRO-ADDON-V1.0B | (C) A. Fachat